# Altium schematic sheet pca10143_sheet1_cover.SchDoc: PCA10143 - Cover
size A3; Organization: Nordic Semiconductor; DocumentNumber: 1; Revision: 0.7.2; SheetNumber: 1; SheetTotal: 7; CompanyName: Nordic Semiconductor
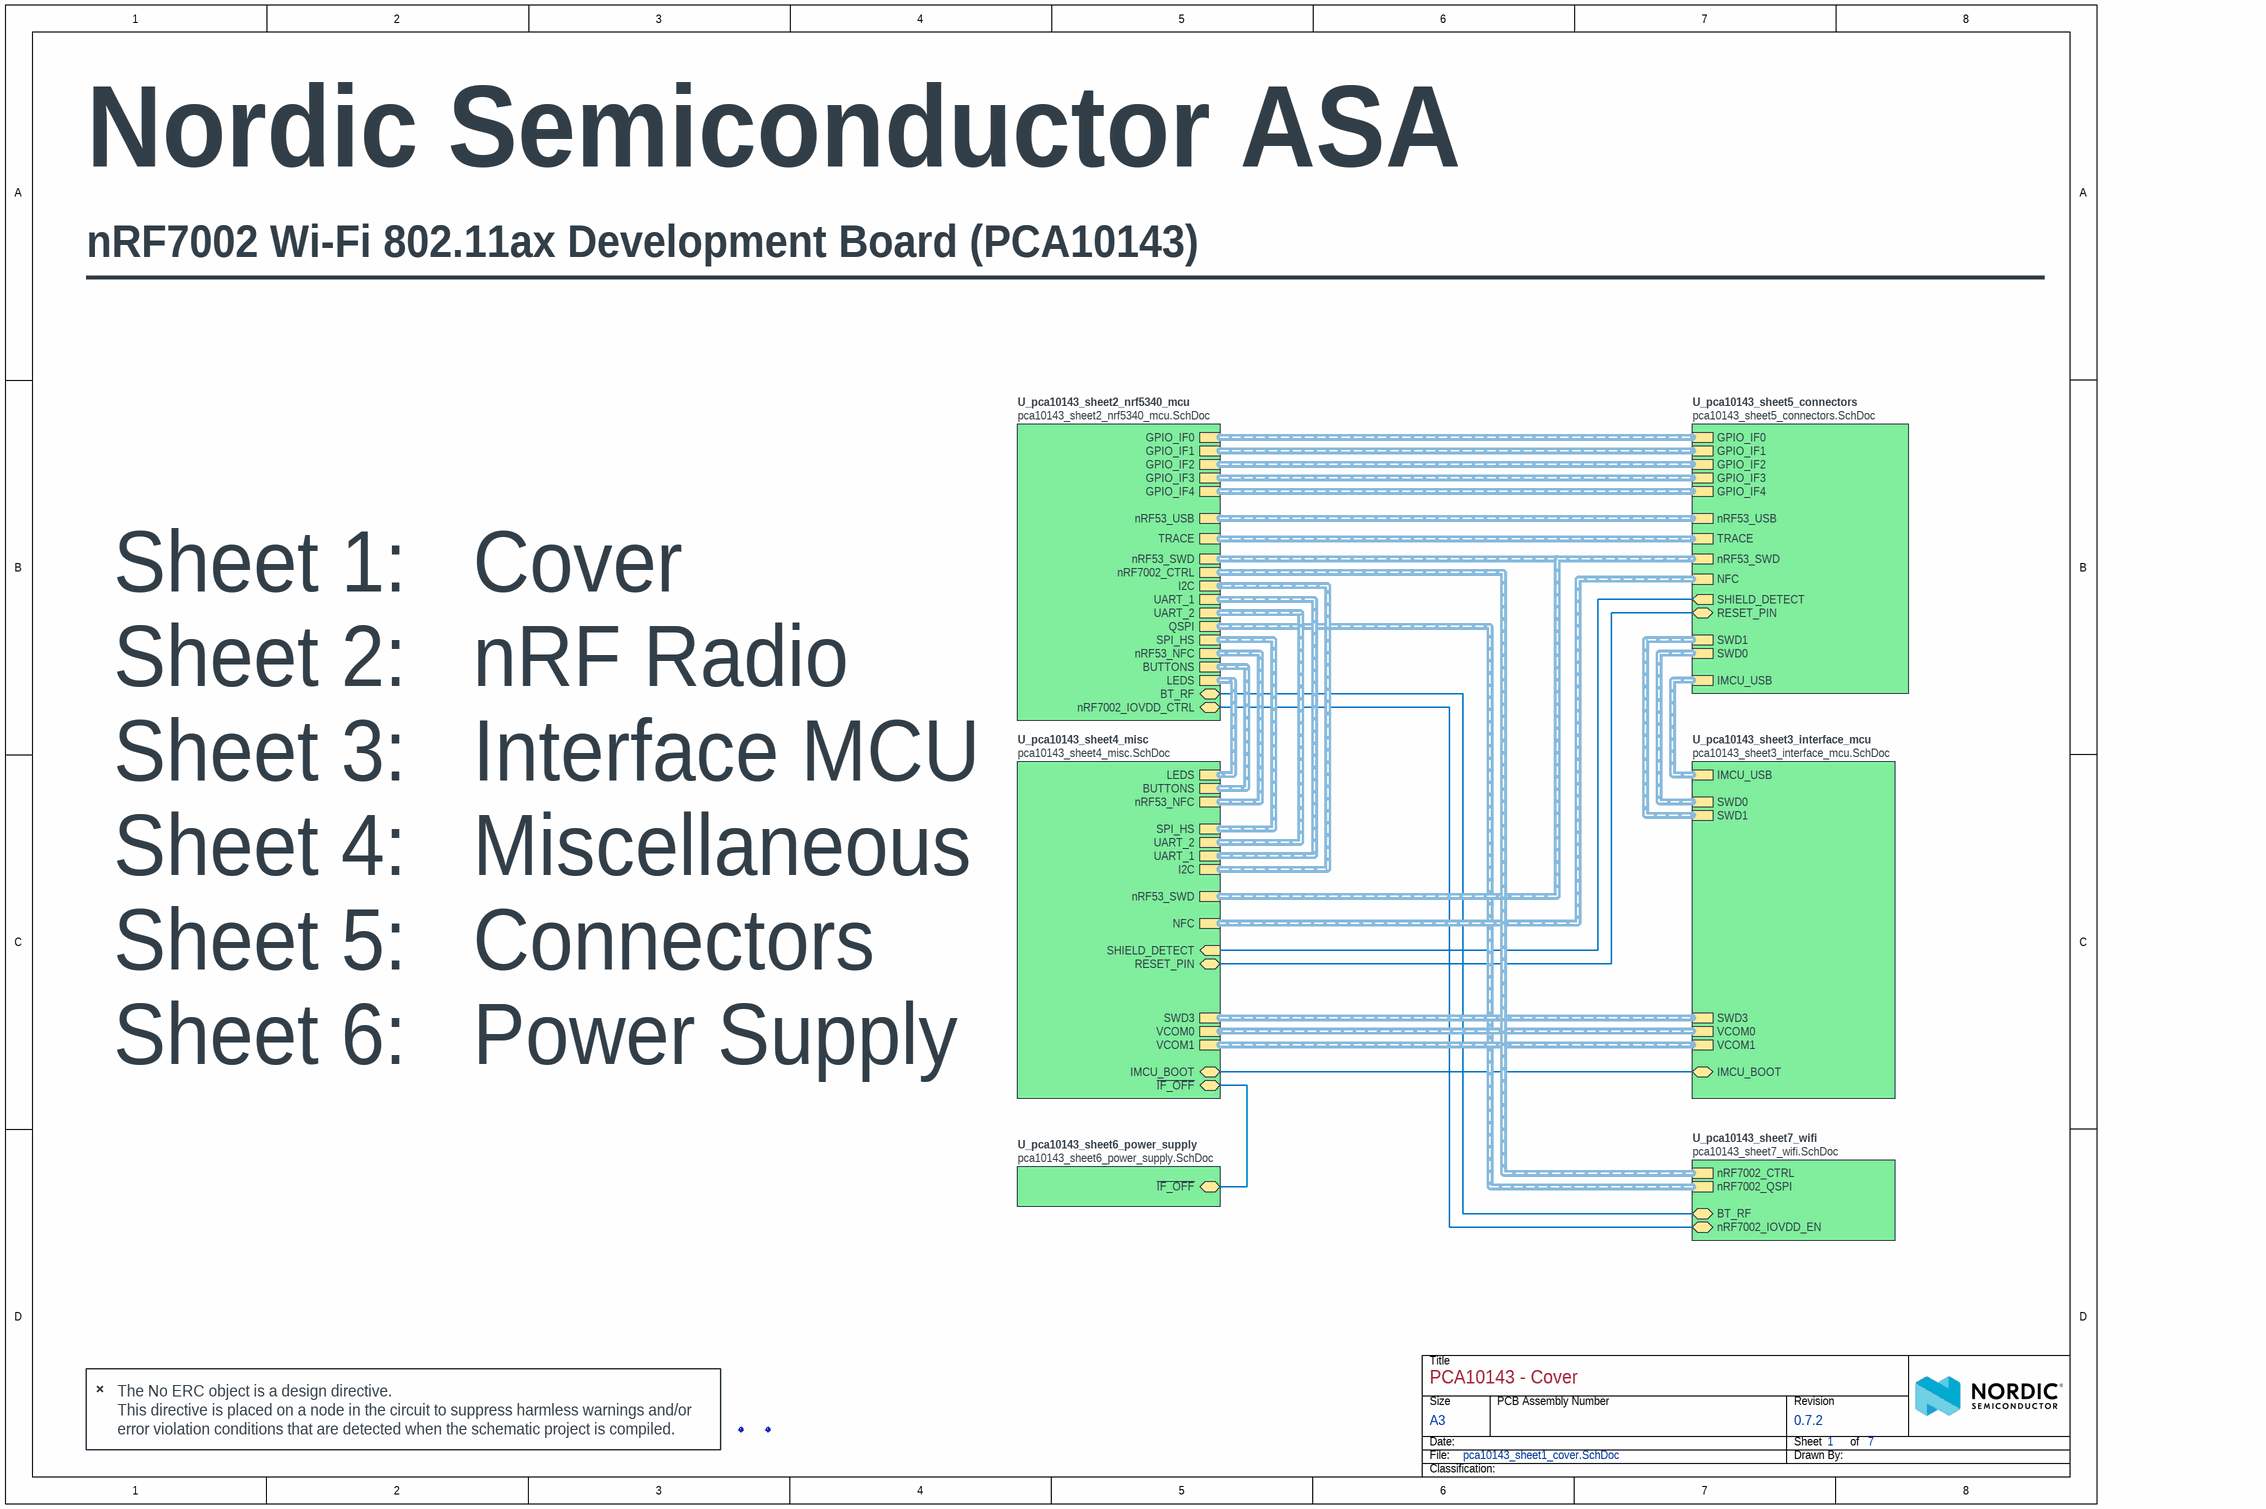
[diagram p0: pca10143_sheet1_cover.SchDoc]

## Parts
Fid1  Fiducial mark  [Fiducial]  (value not drawn)
Fid2  Fiducial mark  [Fiducial]  (value not drawn)

## Sub-sheets
U_pca10143_sheet2_nrf5340_mcu = pca10143_sheet2_nrf5340_mcu.SchDoc: nRF53_SWD (harness SWD), QSPI (harness QSPI), BUTTONS (harness UI), LEDS (harness UI), TRACE (harness TRACE), nRF53_NFC (harness NFC), GPIO_IF1 (harness GPIO_IF1), GPIO_IF2 (harness GPIO_IF2), GPIO_IF0 (harness GPIO_IF0), GPIO_IF3 (harness GPIO_IF3), I2C (harness I2C), GPIO_IF4 (harness GPIO_IF4), UART_1 (harness UART), UART_2 (harness UART), nRF53_USB (harness USB), nRF7002_CTRL (harness WIFICTRL), BT_RF (bidir), SPI_HS (harness SPI), nRF7002_IOVDD_CTRL (bidir)
U_pca10143_sheet3_interface_mcu = pca10143_sheet3_interface_mcu.SchDoc: IMCU_BOOT (bidir), SWD1 (harness SWD), SWD3 (harness SWD), SWD0 (harness SWD), VCOM0 (harness UART), IMCU_USB (harness USB), VCOM1 (harness UART)
U_pca10143_sheet4_misc = pca10143_sheet4_misc.SchDoc: IMCU_BOOT (bidir), RESET_PIN (bidir), ~{IF_OFF} (bidir), SHIELD_DETECT (in), nRF53_SWD (harness SWD), NFC (harness NFC), BUTTONS (harness UI), LEDS (harness UI), SWD3 (harness SWD), VCOM1 (harness UART), I2C (harness I2C), nRF53_NFC (harness NFC), UART_2 (harness UART), UART_1 (harness UART), VCOM0 (harness UART), SPI_HS (harness SPI)
U_pca10143_sheet5_connectors = pca10143_sheet5_connectors.SchDoc: SHIELD_DETECT (out), RESET_PIN (bidir), nRF53_USB (harness USB), nRF53_SWD (harness SWD), TRACE (harness TRACE), NFC (harness NFC), SWD0 (harness SWD), SWD1 (harness SWD), IMCU_USB (harness USB), GPIO_IF0 (harness GPIO_IF0), GPIO_IF1 (harness GPIO_IF1), GPIO_IF2 (harness GPIO_IF2), GPIO_IF3 (harness GPIO_IF3), GPIO_IF4 (harness GPIO_IF4)
U_pca10143_sheet6_power_supply = pca10143_sheet6_power_supply.SchDoc: ~{IF_OFF} (bidir)
U_pca10143_sheet7_wifi = pca10143_sheet7_wifi.SchDoc: nRF7002_CTRL (harness WIFICTRL), nRF7002_QSPI (harness QSPI), BT_RF (bidir), nRF7002_IOVDD_EN (bidir)

## Nets
(unnamed): sheet U_pca10143_sheet2_nrf5340_mcu/BT_RF, sheet U_pca10143_sheet7_wifi/BT_RF
(unnamed): sheet U_pca10143_sheet2_nrf5340_mcu/nRF7002_IOVDD_CTRL, sheet U_pca10143_sheet7_wifi/nRF7002_IOVDD_EN
(unnamed): sheet U_pca10143_sheet3_interface_mcu/IMCU_BOOT, sheet U_pca10143_sheet4_misc/IMCU_BOOT
(unnamed): sheet U_pca10143_sheet4_misc/RESET_PIN, sheet U_pca10143_sheet5_connectors/RESET_PIN
(unnamed): sheet U_pca10143_sheet4_misc/~{IF_OFF}, sheet U_pca10143_sheet6_power_supply/~{IF_OFF}
(unnamed): sheet U_pca10143_sheet4_misc/SHIELD_DETECT, sheet U_pca10143_sheet5_connectors/SHIELD_DETECT

## Buses and harness runs
harness sheet U_pca10143_sheet2_nrf5340_mcu/BUTTONS = sheet U_pca10143_sheet4_misc/BUTTONS
harness sheet U_pca10143_sheet2_nrf5340_mcu/GPIO_IF0 = sheet U_pca10143_sheet5_connectors/GPIO_IF0
harness sheet U_pca10143_sheet2_nrf5340_mcu/GPIO_IF1 = sheet U_pca10143_sheet5_connectors/GPIO_IF1
harness sheet U_pca10143_sheet2_nrf5340_mcu/GPIO_IF2 = sheet U_pca10143_sheet5_connectors/GPIO_IF2
harness sheet U_pca10143_sheet2_nrf5340_mcu/GPIO_IF3 = sheet U_pca10143_sheet5_connectors/GPIO_IF3
harness sheet U_pca10143_sheet2_nrf5340_mcu/GPIO_IF4 = sheet U_pca10143_sheet5_connectors/GPIO_IF4
harness sheet U_pca10143_sheet2_nrf5340_mcu/I2C = sheet U_pca10143_sheet4_misc/I2C
harness sheet U_pca10143_sheet2_nrf5340_mcu/LEDS = sheet U_pca10143_sheet4_misc/LEDS
harness sheet U_pca10143_sheet2_nrf5340_mcu/nRF53_NFC = sheet U_pca10143_sheet4_misc/nRF53_NFC
harness sheet U_pca10143_sheet2_nrf5340_mcu/nRF53_SWD = sheet U_pca10143_sheet4_misc/nRF53_SWD = sheet U_pca10143_sheet5_connectors/nRF53_SWD
harness sheet U_pca10143_sheet2_nrf5340_mcu/nRF53_USB = sheet U_pca10143_sheet5_connectors/nRF53_USB
harness sheet U_pca10143_sheet2_nrf5340_mcu/nRF7002_CTRL = sheet U_pca10143_sheet7_wifi/nRF7002_CTRL
harness sheet U_pca10143_sheet2_nrf5340_mcu/QSPI = sheet U_pca10143_sheet7_wifi/nRF7002_QSPI
harness sheet U_pca10143_sheet2_nrf5340_mcu/SPI_HS = sheet U_pca10143_sheet4_misc/SPI_HS
harness sheet U_pca10143_sheet2_nrf5340_mcu/TRACE = sheet U_pca10143_sheet5_connectors/TRACE
harness sheet U_pca10143_sheet2_nrf5340_mcu/UART_1 = sheet U_pca10143_sheet4_misc/UART_1
harness sheet U_pca10143_sheet2_nrf5340_mcu/UART_2 = sheet U_pca10143_sheet4_misc/UART_2
harness sheet U_pca10143_sheet3_interface_mcu/IMCU_USB = sheet U_pca10143_sheet5_connectors/IMCU_USB
harness sheet U_pca10143_sheet3_interface_mcu/SWD0 = sheet U_pca10143_sheet5_connectors/SWD0
harness sheet U_pca10143_sheet3_interface_mcu/SWD1 = sheet U_pca10143_sheet5_connectors/SWD1
harness sheet U_pca10143_sheet3_interface_mcu/SWD3 = sheet U_pca10143_sheet4_misc/SWD3
harness sheet U_pca10143_sheet3_interface_mcu/VCOM0 = sheet U_pca10143_sheet4_misc/VCOM0
harness sheet U_pca10143_sheet3_interface_mcu/VCOM1 = sheet U_pca10143_sheet4_misc/VCOM1
harness sheet U_pca10143_sheet4_misc/NFC = sheet U_pca10143_sheet5_connectors/NFC

## Notes on the sheet
- Nordic Semiconductor ASA
- nRF7002 Wi-Fi 802.11ax Development Board (PCA10143)
- ________________________________________________________________
- Sheet 1:   Cover
- Sheet 2:   nRF Radio
- Sheet 3:   Interface MCU
- Sheet 4:   Miscellaneous
- Sheet 5:   Connectors
- Sheet 6:   Power Supply
- (near Fid1) The No ERC object is a design directive.
  This directive is placed on a node in the circuit to suppress harmless warnings and/or error violation conditions that are detected when the schematic project is compiled.
- Title
- Size
- Date:
- File:
- A3
- PCB Assembly Number
- Sheet         of
- Drawn By:
- Revision
- Classification:

## Library data of the parts
Fid1 Fid2 = Fid-Mark: Manufacturer: N.A.; Part number NEMS: 100500073; Value: N.A.; Pad Count: 1; Component Status: Active; Part Number: Fid-Mark; Manufacturer Part Number: N.A.; LatestRevisionDate: 2009-12-12; Published: 2009-12-12; Note: N.A.; Artikkelnr Noca: N.A.; Footprint Doc: Fiducial; Part number IPS: N.A.; ComponentLink1URL: N.A.; ComponentLink1Description: Datasheet; ComponentLink2URL: N.A.; ComponentLink2Description: Supplier link; HelpURL: N.A.; Supplier 1: N.A.; Supplier Part Number 1: N.A.; Supplier 2: N.A.; Supplier Part Number 2: N.A.; Author: rsk; Component Class: Connectors; PartId: 100500073; Part number Norautron: N.A.